# Altium project RS422 Breakout.PrjPcb
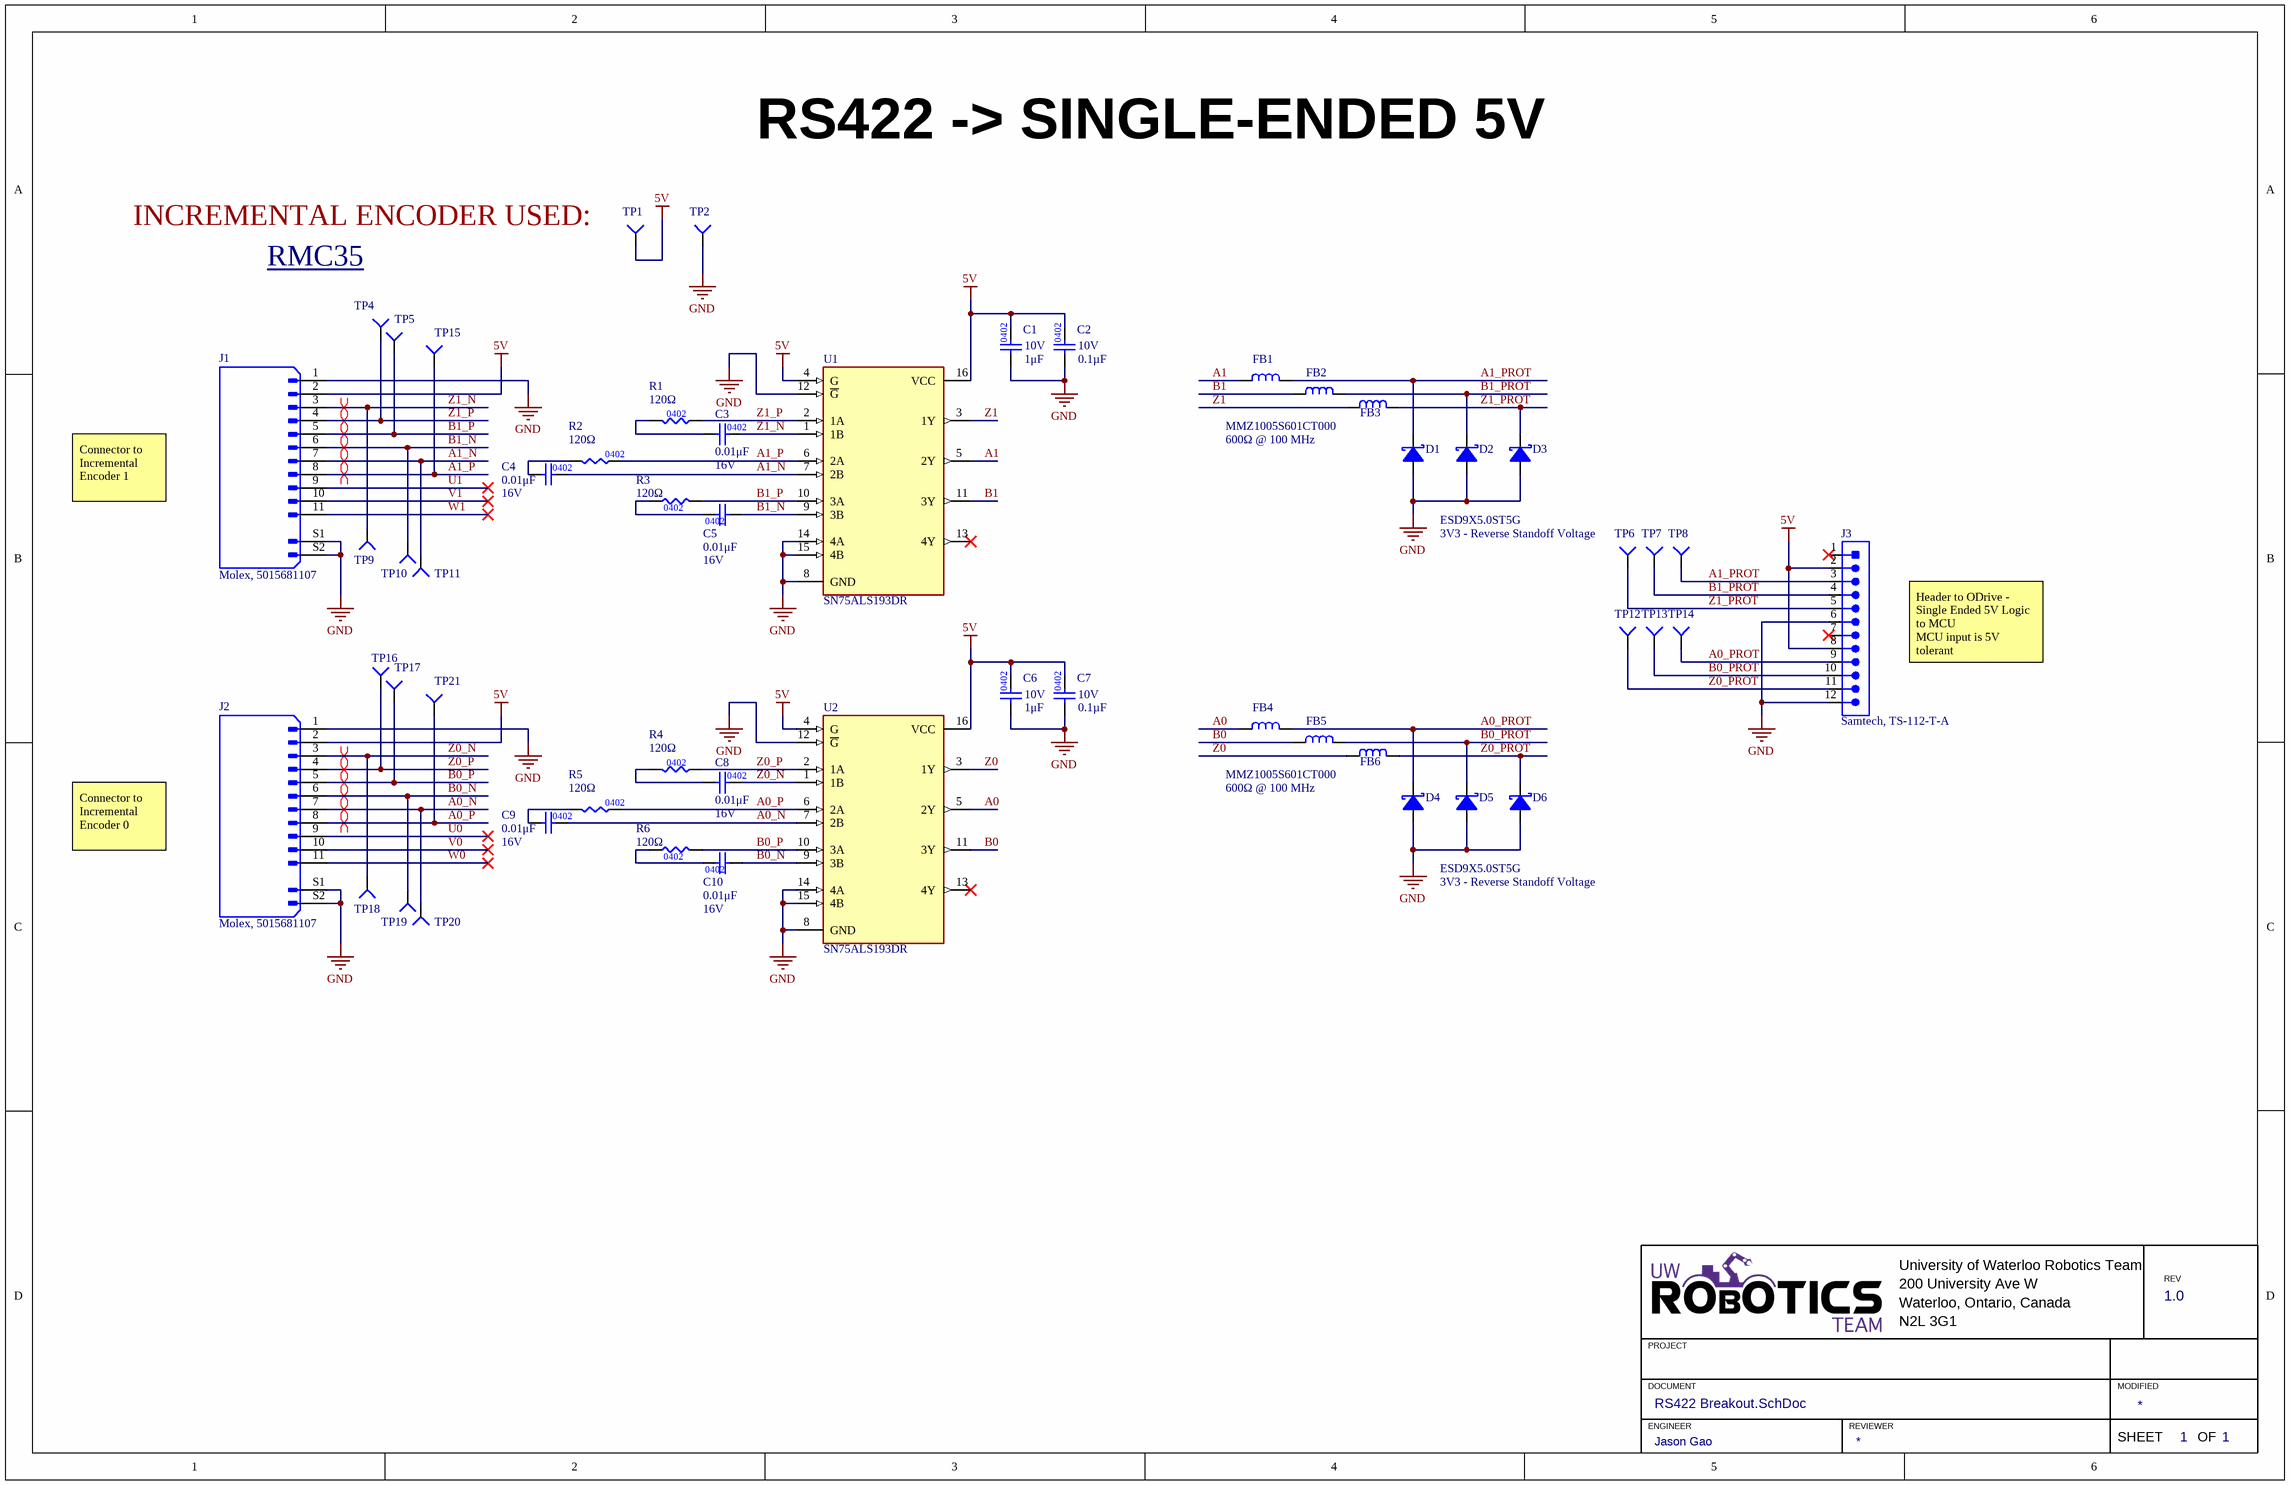
[diagram p0: RS422 Breakout.SchDoc]
1 sheet, 53 parts. Net scope: global (net labels, ports and power ports of the same name join across sheets).
Board file: RS422 Breakout.PcbDoc

## Sheet RS422 Breakout.SchDoc: RS422 -> SINGLE-ENDED 5V
size 431 x 279 mm; Engineer: Jason Gao; Organization: TESLA Motors, INC; Address1: 3500 Deer Creek Road; Address2: Palo Alto, CA; Address4: U.S.A.; Revision: 1.0; SheetNumber: 1; SheetTotal: 1

### Parts
C1  Capacitance: 1μF  Rated DC Voltage (URdc): 10V  [CAP0402]  (hidden comment: CAP_1UF_10V_0402_X5R)
C2  value 0.1µF  Voltage Rating: 10V  [CAP0402]  (hidden comment: CAP_0.1uF_10V_0402)
C3  Capacitance: 0.01μF  Voltage Rating: 16V  [CAP0402]  (hidden comment: CAP_0.01uF_16V_X7R_0402)
C4  Capacitance: 0.01μF  Voltage Rating: 16V  [CAP0402]  (hidden comment: CAP_0.01uF_16V_X7R_0402)
C5  Capacitance: 0.01μF  Voltage Rating: 16V  [CAP0402]  (hidden comment: CAP_0.01uF_16V_X7R_0402)
C6  Capacitance: 1μF  Rated DC Voltage (URdc): 10V  [CAP0402]  (hidden comment: CAP_1UF_10V_0402_X5R)
C7  value 0.1µF  Voltage Rating: 10V  [CAP0402]  (hidden comment: CAP_0.1uF_10V_0402)
C8  Capacitance: 0.01μF  Voltage Rating: 16V  [CAP0402]  (hidden comment: CAP_0.01uF_16V_X7R_0402)
C9  Capacitance: 0.01μF  Voltage Rating: 16V  [CAP0402]  (hidden comment: CAP_0.01uF_16V_X7R_0402)
C10  Capacitance: 0.01μF  Voltage Rating: 16V  [CAP0402]  (hidden comment: CAP_0.01uF_16V_X7R_0402)
D1  Manufacturer Part Number 1: ESD9X5.0ST5G  [sod-923]  (hidden comment: TVS_DIODE_UNIDIR_5V)
D2  TVS_DIODE_UNIDIR_5V  [sod-923]  (value not drawn)
D3  TVS_DIODE_UNIDIR_5V  [sod-923]  (value not drawn)
D4  Manufacturer Part Number 1: ESD9X5.0ST5G  [sod-923]  (hidden comment: TVS_DIODE_UNIDIR_5V)
D5  TVS_DIODE_UNIDIR_5V  [sod-923]  (value not drawn)
D6  TVS_DIODE_UNIDIR_5V  [sod-923]  (value not drawn)
FB1  FERRITE_BEAD_600OHM_0402  [RES0402]  (value not drawn)
FB2  Manufacturer Part Number 1: MMZ1005S601CT000  Impedance @ Frequency: 600Ω @ 100 MHz  [RES0402]  (hidden comment: FERRITE_BEAD_600OHM_0402)
FB3  FERRITE_BEAD_600OHM_0402  [RES0402]  (value not drawn)
FB4  FERRITE_BEAD_600OHM_0402  [RES0402]  (value not drawn)
FB5  Manufacturer Part Number 1: MMZ1005S601CT000  Impedance @ Frequency: 600Ω @ 100 MHz  [RES0402]  (hidden comment: FERRITE_BEAD_600OHM_0402)
FB6  FERRITE_BEAD_600OHM_0402  [RES0402]  (value not drawn)
J1  MP: Molex, 5015681107  [MOLEX-5015681107]  (hidden comment: CON_12M_SM_RA)
J2  MP: Molex, 5015681107  [MOLEX-5015681107]  (hidden comment: CON_12M_SM_RA)
J3  Samtech, TS-112-T-A  [Samtech-TS-112-T-A]
R1  value 120Ω  [RES0402]  (hidden comment: RES_120Ω_0402_5%)
R2  value 120Ω  [RES0402]  (hidden comment: RES_120Ω_0402_5%)
R3  value 120Ω  [RES0402]  (hidden comment: RES_120Ω_0402_5%)
R4  value 120Ω  [RES0402]  (hidden comment: RES_120Ω_0402_5%)
R5  value 120Ω  [RES0402]  (hidden comment: RES_120Ω_0402_5%)
R6  value 120Ω  [RES0402]  (hidden comment: RES_120Ω_0402_5%)
TP1  TESTPOINT_SMD_LOOP  [S1751-46R]  (value not drawn)
TP2  TESTPOINT_SMD_LOOP  [S1751-46R]  (value not drawn)
TP4  TESTPOINT_1MM_SQUARE  [TESTPOINT_SQUARE_1MM]  (value not drawn)  (no BOM)
TP5  TESTPOINT_1MM_SQUARE  [TESTPOINT_SQUARE_1MM]  (value not drawn)  (no BOM)
TP6  TESTPOINT_1MM_CIRCLE  [TESTPOINT_CIRCLE_1MM]  (value not drawn)  (no BOM)
TP7  TESTPOINT_1MM_CIRCLE  [TESTPOINT_CIRCLE_1MM]  (value not drawn)  (no BOM)
TP8  TESTPOINT_1MM_CIRCLE  [TESTPOINT_CIRCLE_1MM]  (value not drawn)  (no BOM)
TP9  TESTPOINT_1MM_CIRCLE  [TESTPOINT_CIRCLE_1MM]  (value not drawn)  (no BOM)
TP10  TESTPOINT_1MM_CIRCLE  [TESTPOINT_CIRCLE_1MM]  (value not drawn)  (no BOM)
TP11  TESTPOINT_1MM_CIRCLE  [TESTPOINT_CIRCLE_1MM]  (value not drawn)  (no BOM)
TP12  TESTPOINT_1MM_CIRCLE  [TESTPOINT_CIRCLE_1MM]  (value not drawn)  (no BOM)
TP13  TESTPOINT_1MM_CIRCLE  [TESTPOINT_CIRCLE_1MM]  (value not drawn)  (no BOM)
TP14  TESTPOINT_1MM_CIRCLE  [TESTPOINT_CIRCLE_1MM]  (value not drawn)  (no BOM)
TP15  TESTPOINT_1MM_SQUARE  [TESTPOINT_SQUARE_1MM]  (value not drawn)  (no BOM)
TP16  TESTPOINT_1MM_SQUARE  [TESTPOINT_SQUARE_1MM]  (value not drawn)  (no BOM)
TP17  TESTPOINT_1MM_SQUARE  [TESTPOINT_SQUARE_1MM]  (value not drawn)  (no BOM)
TP18  TESTPOINT_1MM_CIRCLE  [TESTPOINT_CIRCLE_1MM]  (value not drawn)  (no BOM)
TP19  TESTPOINT_1MM_CIRCLE  [TESTPOINT_CIRCLE_1MM]  (value not drawn)  (no BOM)
TP20  TESTPOINT_1MM_CIRCLE  [TESTPOINT_CIRCLE_1MM]  (value not drawn)  (no BOM)
TP21  TESTPOINT_1MM_SQUARE  [TESTPOINT_SQUARE_1MM]  (value not drawn)  (no BOM)
U1  SN75ALS193DR  [SOIC127P600X175-16N]
U2  SN75ALS193DR  [SOIC127P600X175-16N]

### Nets
5V: C1.2 C2.2 C6.2 C7.2 J1.2 J2.2 J3.2 J3.8 TP1.1(=value) U1.4(G) U1.16(VCC) U2.4(G) U2.16(VCC)
GND: C1.1 C2.1 C6.1 C7.1 D1.2(Anode) D2.2(Anode) D3.2(Anode) D4.2(Anode) D5.2(Anode) D6.2(Anode) J1.1 J1.S1(SHIELD1) J1.S2(SHIELD2) J2.1 J2.S1(SHIELD1) J2.S2(SHIELD2) J3.6 J3.12 TP2.1(=value) U1.8(GND) U1.12(~{G}) U1.14(4A) U1.15(4B) U2.8(GND) U2.12(~{G}) U2.14(4A) U2.15(4B)
A0: FB4.1 U2.5(2Y)
A0_N: C9.2 J2.7 TP20.1(=value) U2.7(2B)
A0_P: J2.8 R5.2 TP21.1(=value) U2.6(2A)
A0_PROT: D4.1(Cathode) FB4.2 J3.9 TP14.1(=value)
A1: FB1.1 U1.5(2Y)
A1_N: C4.2 J1.7 TP11.1(=value) U1.7(2B)
A1_P: J1.8 R2.2 TP15.1(=value) U1.6(2A)
A1_PROT: D1.1(Cathode) FB1.2 J3.3 TP8.1(=value)
B0: FB5.1 U2.11(3Y)
B0_N: C10.2 J2.6 TP19.1(=value) U2.9(3B)
B0_P: J2.5 R6.2 TP17.1(=value) U2.10(3A)
B0_PROT: D5.1(Cathode) FB5.2 J3.10 TP13.1(=value)
B1: FB2.1 U1.11(3Y)
B1_N: C5.2 J1.6 TP10.1(=value) U1.9(3B)
B1_P: J1.5 R3.2 TP5.1(=value) U1.10(3A)
B1_PROT: D2.1(Cathode) FB2.2 J3.4 TP7.1(=value)
U0: J2.9
U1: J1.9
V0: J2.10
V1: J1.10
W0: J2.11
W1: J1.11
Z0: FB6.1 U2.3(1Y)
Z0_N: C8.2 J2.3 TP18.1(=value) U2.1(1B)
Z0_P: J2.4 R4.1 TP16.1(=value) U2.2(1A)
Z0_PROT: D6.1(Cathode) FB6.2 J3.11 TP12.1(=value)
Z1: FB3.1 U1.3(1Y)
Z1_N: C3.2 J1.3 TP9.1(=value) U1.1(1B)
Z1_P: J1.4 R1.1 TP4.1(=value) U1.2(1A)
Z1_PROT: D3.1(Cathode) FB3.2 J3.5 TP6.1(=value)
NetC3_1: C3.1 R1.2
NetC4_1: C4.1 R2.1
NetC5_1: C5.1 R3.1
NetC8_1: C8.1 R4.2
NetC9_1: C9.1 R5.1
NetC10_1: C10.1 R6.1

Not connected (* = marked no-connect by the designer): J3 1* 7(1)*; U1 13(4Y)*; U2 13(4Y)*

### Layout directives
differential pair: A0_N, A0_P, A1_N, A1_P, B0_N, B0_P, B1_N, B1_P, Z0_N, Z0_P, Z1_N, Z1_P

### Notes on the sheet
- INCREMENTAL ENCODER USED:
- RMC35 <https://www.rls.si/eng/fileuploader/download/download/?d=1&file=custom%2Fupload%2FRMC35D01_10.pdf>
- Connector to Incremental Encoder 1
- (near TP6) 3V3 - Reverse Standoff Voltage
- Header to ODrive -
  Single Ended 5V Logic to MCU
  MCU input is 5V tolerant
- Connector to Incremental Encoder 0
- 3V3 - Reverse Standoff Voltage
- University of Waterloo Robotics Team
- 200 University Ave W
- REV
- PROJECT
- Waterloo, Ontario, Canada
- N2L 3G1
- DOCUMENT
- ENGINEER
- REVIEWER
- MODIFIED
- SHEET
- OF
- (in symbol CAP_0.01uF_16V_X7R_0402) 0402

### Library data of the parts
C1 C6 = CAP_1UF_10V_0402_X5R: CAP CER 1UF 10V X5R 0402; Manufacturer: Kyocera AVX; Manufacturer Part Number: 0402ZD105MAT2A; Supplier 1: Digi-Key; Supplier Part Number 1: 478-5768-1-ND; Mounting Type: Surface Mount; Package: 0402; Temperature Characteristics Code: X5R; ComponentLink7URL: https://datasheet.ciiva.com/11531/cx5r-11531784.pdf?src-supplier=Avnet; ComponentLink7Description: https://datasheet.ciiva.com/11531/cx5r-11531784.pdf?src-supplier=Avnet
C2 C7 = CAP_0.1uF_10V_0402: CAP CER 0.1UF 10V X7R 0402; Manufacturer 1: Murata Electronics; Manufacturer Part Number 1: GRM155R71A104KA01D; Package/Footprint: 0402; Supplier 1: Digi-Key; Supplier Part Number 1: 490-6321-1-ND
C3-C5 C8-C10 = CAP_0.01uF_16V_X7R_0402: CAP CER 0.01uF 16V X7R 0402; Manufacturer: KEMET; Manufacturer Part Number: C0402C103J4RACTU; Supplier 1: Digi-Key; Supplier Part Number 1: 399-1039-1-ND; Mounting Type: Surface Mount
D1-D6 = TVS_DIODE_UNIDIR_5V: TVS DIODE 5VWM 12.3VC SOD923; Manufacturer 1: ON Semiconductor; Min Breakdown Voltage: 6.2V; Clamping Voltage-Max: 12.3V; Supplier 1: Digi-Key; Supplier Part Number 1: ESD9X5.0ST5GOSCT-ND
FB1 FB3 FB4 FB6 = FERRITE_BEAD_600OHM_0402: FIXED IND 1UH 3.8A 33 MOHM SMD; Manufacturer 1: TDK Corporation; Manufacturer Part Number 1: MMZ1005S601CT000; DC Resistance (DCR) (Max): 520mΩ; Current Rating (Max): 300mA; Impedance @ Frequency: 600Ω @ 100 MHz; Impedance: 600Ω; Mounting Type: SMD; Package/Footprint: SMD; Package: 0402; Supplier 1: Digi-Key; Supplier Part Number 1: 445-2162-1-ND
FB2 FB5 = FERRITE_BEAD_600OHM_0402: FIXED IND 1UH 3.8A 33 MOHM SMD; Manufacturer 1: TDK Corporation; DC Resistance (DCR) (Max): 520mΩ; Current Rating (Max): 300mA; Impedance: 600Ω; Mounting Type: SMD; Package/Footprint: SMD; Package: 0402; Supplier 1: Digi-Key; Supplier Part Number 1: 445-2162-1-ND
J1 J2 = CON_11M_SM_RA: CONN HEADER SMD RIGHT ANGLE 1MM PITCH; Availability: Unavailable; Value: *; Package: None; Price: None; Supplier 1: Digi-Key; Supplier Part Number 1: WM7902CT-ND
J3 = CON_12M_TH_VERT_2.54mm: CONN HEADER THROUGH HOLE VERTICAL 2.54MM PITCH; Supplier 1: Digi-Key; Supplier Part Number 1: SAM12216-ND; Manufacturing Part Number: Samtech, TS-112-T-A
R1-R6 = RES_120Ω_0402_5%: RES 120 OHM 5% 1/16W 0402; Manufacturer Part Number 1: RC0402JR-07120RL; Manufacturer 1: Yageo; Package/Footprint: 0402; Supplier 1: Digi-Key; Supplier Part Number 1: 311-120JRCT-ND; Mounting Type: SMD; Power: 1/16W; Tolerance: 5%
TP1 TP2 = TESTPOINT_SMD_LOOP: TESTPOINT SMD LOOP; Manufacturer 1: Harwin; Supplier 1: Digi-Key; Manufacturer Part Number 1: S1751-46R; Mounting Type: SMD; Package/Footprint: SMD; Supplier Part Number 1: 952-1478-1-ND
TP4 TP5 TP15-TP17 TP21 = TESTPOINT_1MM_SQUARE: TESTPOINT 1MM SQUARE
TP6-TP14 TP18-TP20 = TESTPOINT_1MM_CIRCLE: TESTPOINT 1MM CIRCLE
U1 U2 = SN75ALS193DR: 0/4 Receiver - RS422, RS423 16-SOIC; Mfr_Name: Texas Instruments; Copyright: Copyright (C) 2021 Ultra Librarian. All rights reserved.; Manufacturer_Part_Number: SN75ALS193DR; RefDes: RefDes; Type: DEV; Supplier 1: Digi-Key; Supplier Part Number 1: 296-24362-1-ND